# Altium project LORA1121.PrjPcb
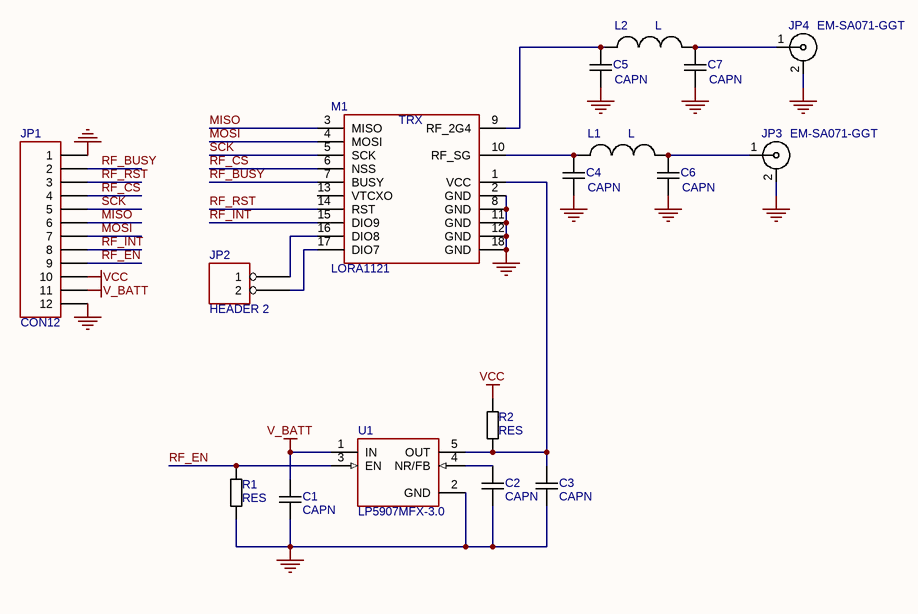
[diagram p0: lora1121m.SchDoc]
1 sheet, 17 parts. Net scope: global (net labels, ports and power ports of the same name join across sheets).
Board file: lora1121m.PcbDoc

## Sheet lora1121m.SchDoc
size A4; SheetNumber: 1; SheetTotal: 1

### Parts
C1  CAPN  [C-0805]
C2  CAPN  [C-0603]
C3  CAPN  [C-0805]
C4  CAPN  [C-0603]
C5  CAPN  [C-0603]
C6  CAPN  [C-0603]
C7  CAPN  [C-0603]
JP1  CON12  [PBS1-12R]
JP2  HEADER 2  [PLS1-2]
JP3  EM-SA071-GGT  [SMA_F_EDGE]
JP4  EM-SA071-GGT  [SMA_F_EDGE]
L1  L  [L-0603]
L2  L  [L-0603]
M1  LORA1121  [LORA1121]
R1  RES  [R-0603]
R2  RES  [R-0603]
U1  LP5907MFX-3.0  [SOT-23-5]

### Nets
GND: C1.2 C2.2 C3.2 C4.2 C5.2 C6.2 C7.2 JP1.1 JP1.12 JP3.2 JP4.2 M1.2(GND) M1.8(GND) M1.11(GND) M1.12(GND) M1.18(GND) R1.1 U1.2(GND)
V_BATT: C1.1 JP1.11 U1.1(IN)
VCC: JP1.10 R2.2
MISO: JP1.6 M1.3(MISO)
MOSI: JP1.7 M1.4(MOSI)
RF_BUSY: JP1.2 M1.7(BUSY)
RF_CS: JP1.4 M1.6(NSS)
RF_EN: JP1.9 R1.2 U1.3(EN)
RF_INT: JP1.8 M1.15(DIO9)
RF_RST: JP1.3 M1.14(RST)
SCK: JP1.5 M1.5(SCK)
NetC2_1: C2.1 U1.4(NR/FB)
NetC3_1: C3.1 M1.1(VCC) R2.1 U1.5(OUT)
NetC4_1: C4.1 L1.1 M1.10(RF_SG)
NetC5_1: C5.1 L2.1 M1.9(RF_2G4)
NetC6_1: C6.1 JP3.1 L1.2
NetC7_1: C7.1 JP4.1 L2.2
NetJP2_1: JP2.1 M1.16(DIO8)
NetJP2_2: JP2.2 M1.17(DIO7)

Not connected (* = marked no-connect by the designer): M1 13(VTCXO)

### Notes on the sheet
- (in symbol LORA1121) TRX

### Library data of the parts
C1-C7 = CAPN: Voltage: 50V; Точність/група: NP0; Вид: Конденсатор
JP1 = CON12: Connector; Вид: Роз'єм; *: *
JP2 = HEADER 2: Вид: Роз'єм; *: *
JP3 JP4 = SMA: SMA Female R/A PCB Mount; Вид: Роз'єм
L1 L2 = L: Вид: Індуктивність
R1 R2 = RES: Точність/група: 5%; Вид: Резистор
U1 = LP5907: 250mA Low-Dropout Regulator; Вид: Мікросхема